# EAGLE schematic BoostConverter(using ATmega328P) (EAGLE 9.6.0)
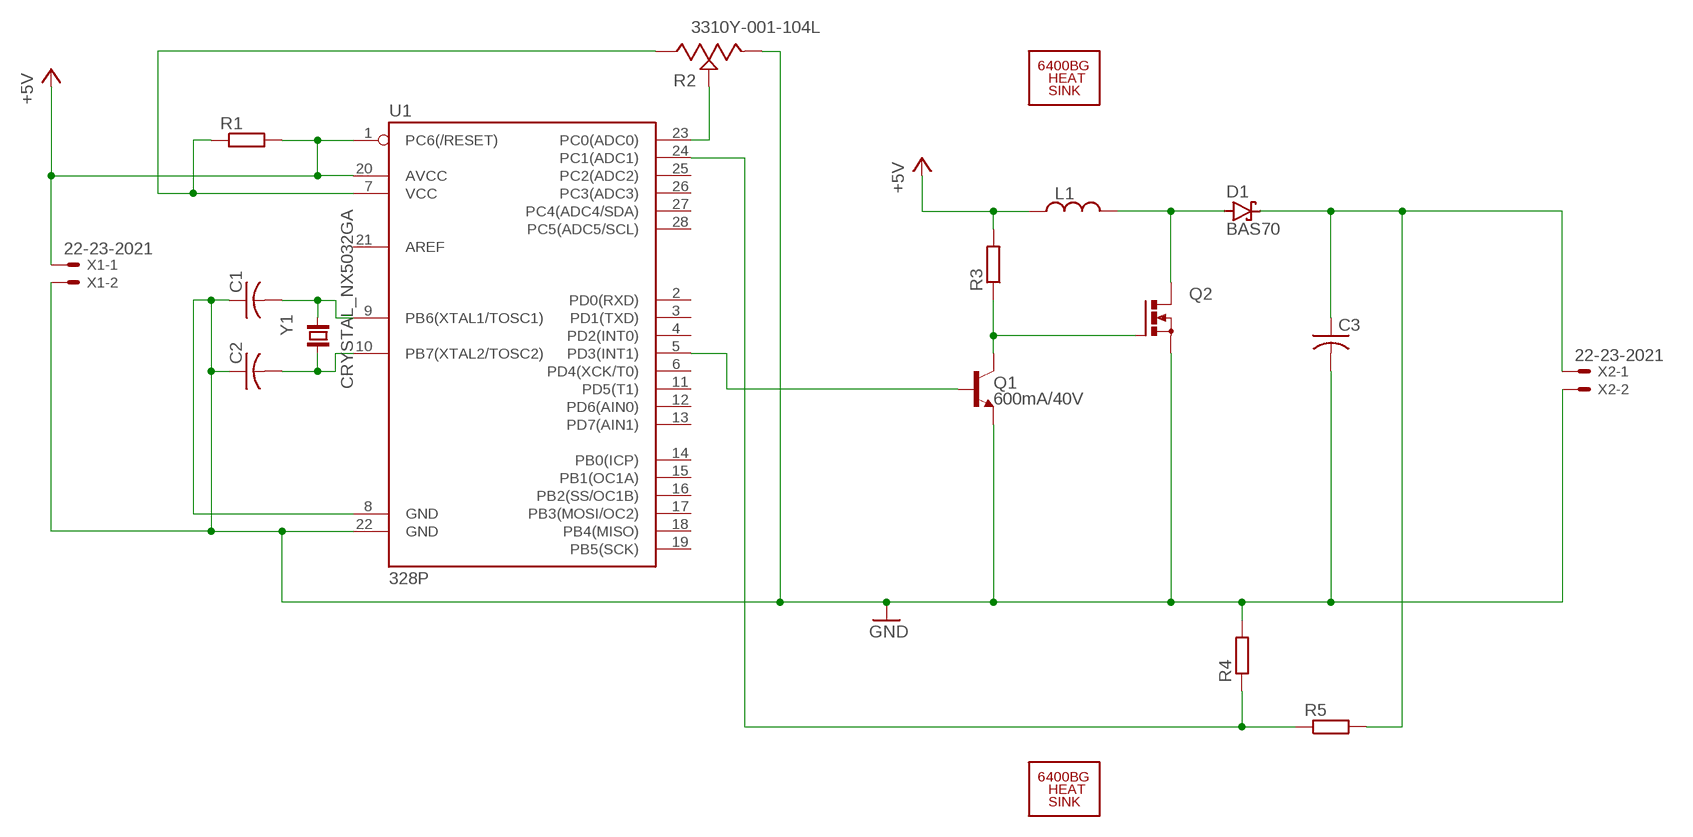
[diagram p0: schematic, sheet 1]

## Parts
C1  C-USC0805  [C0805]
C2  C-USC0805  [C0805]
C3  C-USC0805  [C0805]
D1  BAS70  [SOT23]
H1  6400BG_HEATSINK  [6400BG_HEATSINK]
H2  6400BG_HEATSINK  [6400BG_HEATSINK]
L1  L_CHIP(4509-METRIC)  [INDC4509X190]
Q1  600mA/40V  TRANS_NPN-MMBT2222AL  [SOT23-3]
Q2  N-MOSFET-SO8S  [SO-08]
R1  R-EU_R0805  [R0805]
R2  3310Y-001-104L  [3310Y-001-104L-ND]
R3  R-EU_M1406  [M1406]
R4  R-EU_M0805  [M0805]
R5  R-EU_M0805  [M0805]
U1  328P  ATMEGA328P_PDIP  [DIP28]
X1  22-23-2021  [22-23-2021]
X2  22-23-2021  [22-23-2021]
Y1  CRYSTAL_NX5032GA  [CRYSTAL_2-SMD-5X3]

## Nets
+5V: L1.1 R1.2 R3.2 U1.1(PC6(/RESET)) U1.20(AVCC) X1.1
GND: C1.1 C2.1 C3.2 Q1.2(E) Q2.1(S) Q2.2(S) Q2.3(S) R2.1 R4.2 U1.8(GND) U1.22(GND) X1.2 X2.2
N$1: C1.2 U1.9(PB6(XTAL1/TOSC1)) Y1.2
N$2: C2.2 U1.10(PB7(XTAL2/TOSC2)) Y1.1
N$3: R4.1 R5.1 U1.24(PC1(ADC1))
N$4: Q1.3(C) Q2.4(G) R3.1
N$5: R2.2 U1.23(PC0(ADC0))
N$6: Q1.1(B) U1.5(PD3(INT1))
N$7: D1.1(A) L1.2 Q2.5(D) Q2.6(D) Q2.7(D) Q2.8(D)
N$8: C3.1 D1.3(C) R5.2 X2.1
N$9: R1.1 R2.3 U1.7(VCC)
Unconnected: U1.2(PD0(RXD)) U1.3(PD1(TXD)) U1.4(PD2(INT0)) U1.6(PD4(XCK/T0)) U1.11(PD5(T1)) U1.12(PD6(AIN0)) U1.13(PD7(AIN1)) U1.14(PB0(ICP)) U1.15(PB1(OC1A)) U1.16(PB2(SS/OC1B)) U1.17(PB3(MOSI/OC2)) U1.18(PB4(MISO)) U1.19(PB5(SCK)) U1.21(AREF) U1.25(PC2(ADC2)) U1.26(PC3(ADC3)) U1.27(PC4(ADC4/SDA)) U1.28(PC5(ADC5/SCL))

## Library data of the parts
C1-C3 = rcl:C-US: CAPACITOR, American symbol; SPICEPREFIX: C
D1 = diode:BAS70: Silicon Schottky Diodes General-purpose diode for high-speed switching
H1 H2 = SparkFun-Hardware:6400BG_HEATSINK: 6400BG Heatsink - Multiwatt Package This beefy heatsink is designed to dissipate a lot of heat! The 6400BG heatsink fits TO-220, TO-218, TO-247, and Multiwatt packages - which means it’s a great fit for the STA540 <http://www.sparkfun.com/commerce/product_info.php?products_id=9557>, L298N <http://www.sparkfun.com/commerce/product_info.php?products_id=9479>, and all of our T-220 package voltage regulators <http://www.sparkfun.com/commerce/advanced_search_result.php?keywords=TO-220+COM&x=21&y=16&search_section=products>. SparkFun Products Heat Sink - Multiwatt Package <https://www.sparkfun.com/products/9576> (PRT-09576); PROD_ID: COMP-09537; SF_SKU: PRT-09576
L1 = Inductor:L: Inductor Fixed - Generic; CATEGORY: Inductor; SUB-CATEGORY: Fixed
Q1 = SparkFun-DiscreteSemi:TRANS_NPN: NPN transistor Current controlled devices typically used to amplify current or used as a switch. BC547 - COM-08928 <http://www.sparkfun.com/products/8928> (TO-92 45V 100mA) (1.Collector 2.Base 3.Emitter) 2N3904 - COM-00521 <http://www.sparkfun.com/products/521> (TO-92 40V 200mA) (1.Emitter 2.Base 3.Collector) P2N2222A - COM-12852 <http://www.sparkfun.com/products/12852> (TO-92 40V 600mA) (1.Collector 2.Base 3.Emitter); PROD_ID: TRANS-08049
Q2 = transistor-power:N-MOSFET-SO8: N-Channel MOSFET Example: FDS7760A; N-Channel Logic Level PowerTrench® MOSFET FDS2572; N-Channel UltraFET® Trench MOSFET Source: www.fairchildsemi.com
R1 R3-R5 = rcl:R-EU_: RESISTOR, European symbol; SPICEPREFIX: R
R2 = Potentiometer_Trimmers:3310Y-001-104L: POT 100K OHM 1/4W PLASTIC LINEAR Manufacturer's datasheet <https://www.bourns.com/docs/Product-Datasheets/3310.pdf>; CREATED_BY: PCBLayout.com; DIGIKEY_PARTNO: 3310Y-001-104L-ND; MANUFACTURER: Bourns Inc.; MPN: 3310Y-001-104L
U1 = SparkFun-IC-Microcontroller:ATMEGA328P_PDIP: Atmel 328P Through hole ATMEGA328P uC used in the Arduino 32kb flash, 1k EEPROM, 2k SRAM Datasheet <http://www.sparkfun.com/datasheets/Components/SMD/ATMega328.pdf> SparkFun Products Storefront component: AVR 28 Pin 20MHz 32K 6A/D - ATMega328P <https://www.sparkfun.com/products/9061> (COM-09061) SparkFun Simon Says - Through-Hole Soldering Kit <https://www.sparkfun.com/products/10547> (KIT-10547) SparkFun Learn to Solder - Simon Says <https://www.sparkfun.com/products/13708> (KIT-13708) SparkFun BigTime Watch Kit <https://www.sparkfun.com/products/11734> (KIT-11734) SparkFun ClockIt <https://www.sparkfun.com/products/10930> (KIT-10930) SparkFun Serial Enabled LCD Kit <https://www.sparkfun.com/products/10097> (LCD-10097) SparkFun Simon Tilts - Through Hole Soldering Kit <https://www.sparkfun.com/products/12634> (KIT-12634) SparkFun Frequency Counter Kit <https://www.sparkfun.com/products/10140> (KIT-10140) FabFM Radio Kit <https://www.sparkfun.com/products/11043> (KIT-11043) SparkFun Binary Blaster Kit <https://www.sparkfun.com/products/12037> (KIT-12037) SparkFun Metro-Gnome <https://www.sparkfun.com/products/9236> (KIT-09236) ATmega328 with Arduino Optiboot (Uno) <https://www.sparkfun.com/products/10524> (DEV-10524); PROD_ID: IC-09136
X1 X2 = con-molex:22-23-2021: .100" (2.54mm) Center Header - 2 Pin; MF: MOLEX; MPN: 22-23-2021; OC_FARNELL: 1462926; OC_NEWARK: 25C3832
Y1 = 52101-101-REV-A:CRYSTAL_NX5032GA: CRYSTAL

## Net classes
0 default: width 0.61 mm, drill 0.686 mm, clearance 0.254 mm